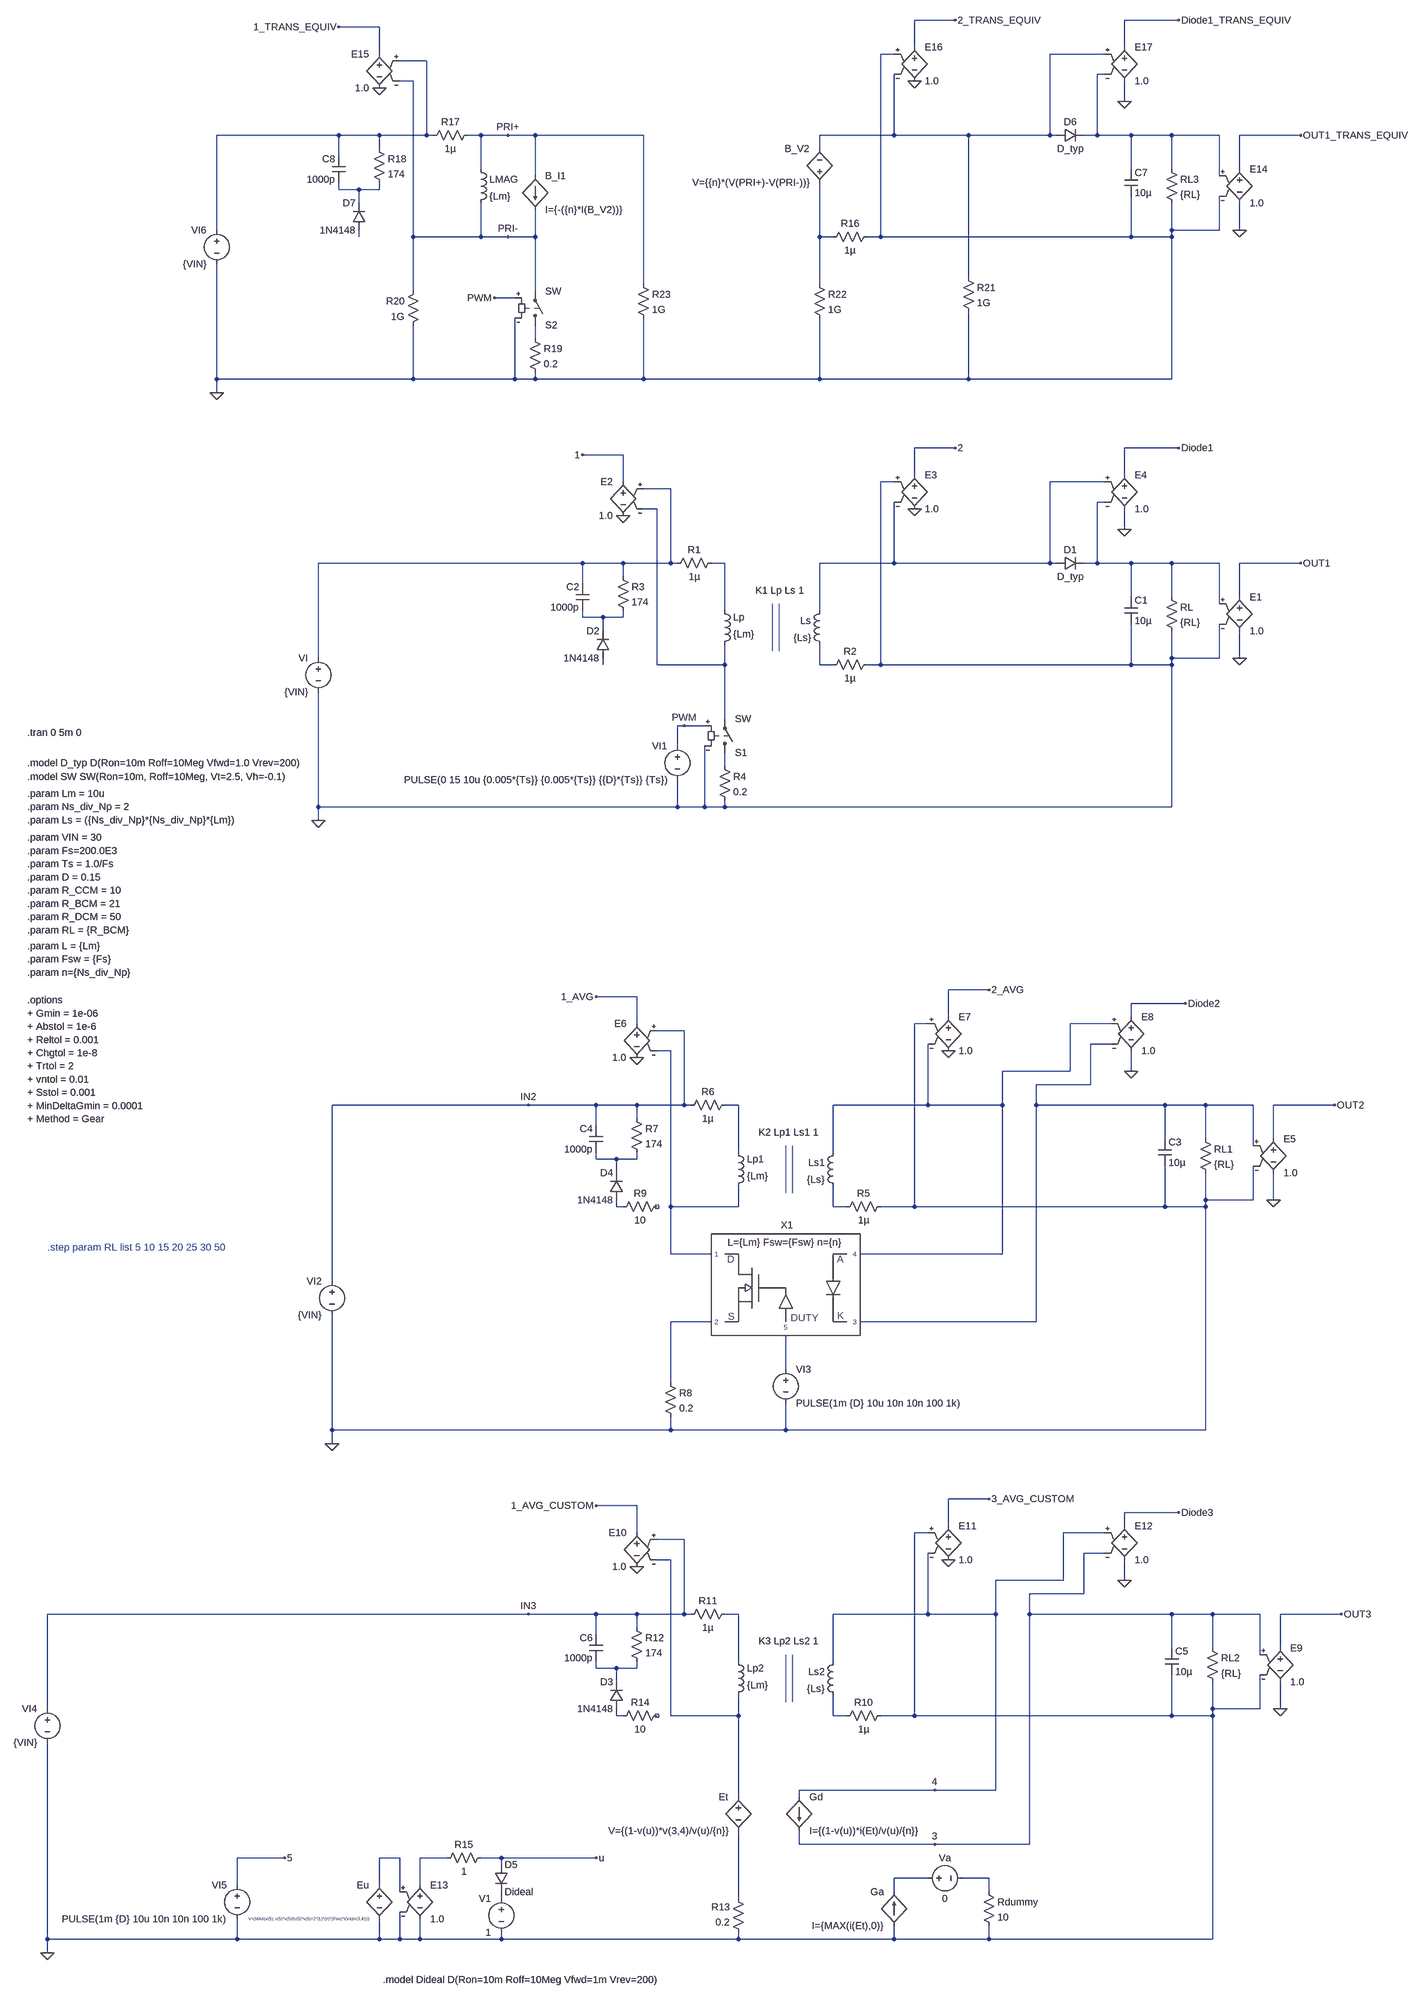
[diagram p0: schematic Flyback_Basic_Model.asc]
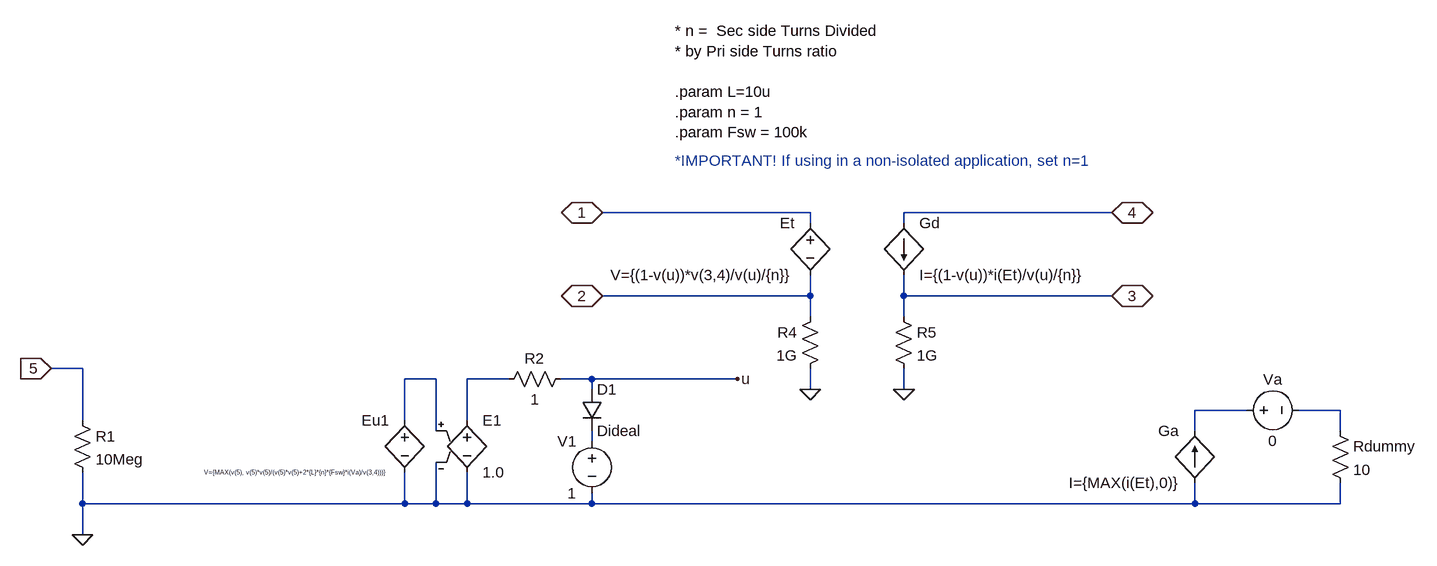
[diagram p1: sub-circuit ccm-dcm2.asc]
Flyback_Basic_Model.asc, the LTspice schematic file:
Version 4.1
SHEET 1 1936 3524
WIRE 624 -1312 528 -1312
WIRE 1152 -1312 1024 -1312
WIRE -736 -1296 -832 -1296
WIRE 528 -1248 528 -1312
WIRE 1024 -1248 1024 -1312
WIRE -736 -1232 -736 -1296
WIRE 480 -1232 448 -1232
WIRE 976 -1232 848 -1232
WIRE -624 -1216 -688 -1216
WIRE 976 -1184 960 -1184
WIRE -656 -1168 -688 -1168
WIRE 1024 -1120 1024 -1168
WIRE -832 -1040 -1120 -1040
WIRE -736 -1040 -832 -1040
WIRE -624 -1040 -624 -1216
WIRE -624 -1040 -736 -1040
WIRE -608 -1040 -624 -1040
WIRE -496 -1040 -528 -1040
WIRE -432 -1040 -496 -1040
WIRE -368 -1040 -432 -1040
WIRE -112 -1040 -368 -1040
WIRE 480 -1040 480 -1184
WIRE 480 -1040 304 -1040
WIRE 656 -1040 480 -1040
WIRE 848 -1040 848 -1232
WIRE 848 -1040 656 -1040
WIRE 864 -1040 848 -1040
WIRE 960 -1040 960 -1184
WIRE 960 -1040 928 -1040
WIRE 1040 -1040 960 -1040
WIRE 1136 -1040 1040 -1040
WIRE 1248 -1040 1136 -1040
WIRE 1440 -1040 1296 -1040
WIRE -736 -1008 -736 -1040
WIRE 304 -1008 304 -1040
WIRE -832 -992 -832 -1040
WIRE -496 -960 -496 -1040
WIRE 1040 -960 1040 -1040
WIRE 1136 -960 1136 -1040
WIRE 1296 -960 1296 -1040
WIRE -368 -944 -368 -1040
WIRE 1248 -944 1248 -1040
WIRE -832 -912 -832 -928
WIRE -784 -912 -832 -912
WIRE -736 -912 -736 -928
WIRE -736 -912 -784 -912
WIRE -784 -880 -784 -912
WIRE -1120 -816 -1120 -1040
WIRE 1136 -816 1136 -880
WIRE 1248 -816 1248 -896
WIRE 1248 -816 1136 -816
WIRE 1296 -816 1296 -880
WIRE -784 -800 -784 -816
WIRE -656 -800 -656 -1168
WIRE -496 -800 -496 -880
WIRE -496 -800 -656 -800
WIRE -432 -800 -496 -800
WIRE -368 -800 -368 -864
WIRE -368 -800 -432 -800
WIRE 304 -800 304 -928
WIRE 336 -800 304 -800
WIRE 448 -800 448 -1232
WIRE 448 -800 416 -800
WIRE 1040 -800 1040 -896
WIRE 1040 -800 448 -800
WIRE 1136 -800 1136 -816
WIRE 1136 -800 1040 -800
WIRE 656 -704 656 -1040
WIRE -112 -688 -112 -1040
WIRE 304 -688 304 -800
WIRE -656 -672 -656 -800
WIRE -368 -672 -368 -800
WIRE -416 -656 -464 -656
WIRE -368 -560 -368 -592
WIRE -1120 -464 -1120 -736
WIRE -656 -464 -656 -592
WIRE -656 -464 -1120 -464
WIRE -416 -464 -416 -608
WIRE -416 -464 -656 -464
WIRE -368 -464 -368 -480
WIRE -368 -464 -416 -464
WIRE -112 -464 -112 -608
WIRE -112 -464 -368 -464
WIRE 304 -464 304 -608
WIRE 304 -464 -112 -464
WIRE 656 -464 656 -624
WIRE 656 -464 304 -464
WIRE 1136 -464 1136 -800
WIRE 1136 -464 656 -464
WIRE -1120 -432 -1120 -464
WIRE 624 -288 528 -288
WIRE 1152 -288 1024 -288
WIRE -160 -272 -256 -272
WIRE 528 -224 528 -288
WIRE 1024 -224 1024 -288
WIRE -160 -208 -160 -272
WIRE 480 -208 448 -208
WIRE 976 -208 848 -208
WIRE -48 -192 -112 -192
WIRE 976 -160 960 -160
WIRE -80 -144 -112 -144
WIRE 1024 -96 1024 -144
WIRE -256 -16 -880 -16
WIRE -160 -16 -256 -16
WIRE -48 -16 -48 -192
WIRE -48 -16 -160 -16
WIRE -32 -16 -48 -16
WIRE 80 -16 48 -16
WIRE 480 -16 480 -160
WIRE 480 -16 304 -16
WIRE 848 -16 848 -208
WIRE 848 -16 480 -16
WIRE 864 -16 848 -16
WIRE 960 -16 960 -160
WIRE 960 -16 928 -16
WIRE 1040 -16 960 -16
WIRE 1136 -16 1040 -16
WIRE 1248 -16 1136 -16
WIRE 1440 -16 1296 -16
WIRE -160 16 -160 -16
WIRE -256 32 -256 -16
WIRE 1040 64 1040 -16
WIRE 1136 64 1136 -16
WIRE 1296 64 1296 -16
WIRE 1248 80 1248 -16
WIRE 80 96 80 -16
WIRE 304 96 304 -16
WIRE -256 112 -256 96
WIRE -208 112 -256 112
WIRE -160 112 -160 96
WIRE -160 112 -208 112
WIRE -208 144 -208 112
WIRE -880 208 -880 -16
WIRE 1136 208 1136 144
WIRE 1248 208 1248 128
WIRE 1248 208 1136 208
WIRE 1296 208 1296 144
WIRE -208 224 -208 208
WIRE -80 224 -80 -144
WIRE 80 224 80 176
WIRE 80 224 -80 224
WIRE 304 224 304 176
WIRE 336 224 304 224
WIRE 448 224 448 -208
WIRE 448 224 416 224
WIRE 1040 224 1040 128
WIRE 1040 224 448 224
WIRE 1136 224 1136 208
WIRE 1136 224 1040 224
WIRE 80 352 80 224
WIRE -16 368 -32 368
WIRE 32 368 -16 368
WIRE -32 416 -32 368
WIRE 80 464 80 432
WIRE -880 560 -880 288
WIRE -32 560 -32 496
WIRE -32 560 -880 560
WIRE 32 560 32 416
WIRE 32 560 -32 560
WIRE 80 560 80 544
WIRE 80 560 32 560
WIRE 1136 560 1136 224
WIRE 1136 560 80 560
WIRE -880 592 -880 560
WIRE 704 992 608 992
WIRE -128 1008 -224 1008
WIRE 1168 1024 1040 1024
WIRE 608 1056 608 992
WIRE 1040 1056 1040 1024
WIRE -128 1072 -128 1008
WIRE 560 1072 528 1072
WIRE 992 1072 896 1072
WIRE -16 1088 -80 1088
WIRE 992 1120 944 1120
WIRE -48 1136 -80 1136
WIRE 896 1184 896 1072
WIRE 896 1184 736 1184
WIRE 1040 1184 1040 1136
WIRE 944 1216 944 1120
WIRE 944 1216 816 1216
WIRE -384 1264 -848 1264
WIRE -224 1264 -384 1264
WIRE -128 1264 -224 1264
WIRE -16 1264 -16 1088
WIRE -16 1264 -128 1264
WIRE 0 1264 -16 1264
WIRE 112 1264 80 1264
WIRE 560 1264 560 1120
WIRE 560 1264 336 1264
WIRE 736 1264 736 1184
WIRE 736 1264 560 1264
WIRE 816 1264 816 1216
WIRE 1120 1264 816 1264
WIRE 1216 1264 1120 1264
WIRE 1328 1264 1216 1264
WIRE 1520 1264 1376 1264
WIRE -128 1296 -128 1264
WIRE -224 1312 -224 1264
WIRE 1120 1344 1120 1264
WIRE 1216 1344 1216 1264
WIRE 1376 1344 1376 1264
WIRE 1328 1360 1328 1264
WIRE 112 1376 112 1264
WIRE 336 1376 336 1264
WIRE -224 1392 -224 1376
WIRE -176 1392 -224 1392
WIRE -128 1392 -128 1376
WIRE -128 1392 -176 1392
WIRE -176 1424 -176 1392
WIRE 1216 1488 1216 1424
WIRE 1328 1488 1328 1408
WIRE 1328 1488 1216 1488
WIRE 1376 1488 1376 1424
WIRE -176 1504 -176 1488
WIRE -160 1504 -176 1504
WIRE -48 1504 -48 1136
WIRE 112 1504 112 1456
WIRE 112 1504 -48 1504
WIRE 336 1504 336 1456
WIRE 368 1504 336 1504
WIRE 528 1504 528 1072
WIRE 528 1504 448 1504
WIRE 1120 1504 1120 1408
WIRE 1120 1504 528 1504
WIRE 1216 1504 1216 1488
WIRE 1216 1504 1120 1504
WIRE -48 1616 -48 1504
WIRE 48 1616 -48 1616
WIRE 736 1616 736 1264
WIRE 736 1616 400 1616
WIRE -848 1680 -848 1264
WIRE 48 1776 -48 1776
WIRE 816 1776 816 1264
WIRE 816 1776 400 1776
WIRE 224 1888 224 1808
WIRE -48 1920 -48 1776
WIRE -848 2032 -848 1760
WIRE -48 2032 -48 2000
WIRE -48 2032 -848 2032
WIRE 224 2032 224 1968
WIRE 224 2032 -48 2032
WIRE 1216 2032 1216 1504
WIRE 1216 2032 224 2032
WIRE -848 2064 -848 2032
WIRE 704 2256 608 2256
WIRE -128 2272 -224 2272
WIRE 1152 2288 1024 2288
WIRE 608 2320 608 2256
WIRE 1024 2320 1024 2288
WIRE -128 2336 -128 2272
WIRE 560 2336 528 2336
WIRE 976 2336 880 2336
WIRE -16 2352 -80 2352
WIRE 976 2384 928 2384
WIRE -48 2400 -80 2400
WIRE 880 2448 880 2336
WIRE 880 2448 720 2448
WIRE 1024 2448 1024 2400
WIRE 928 2480 928 2384
WIRE 928 2480 800 2480
WIRE -384 2528 -1520 2528
WIRE -224 2528 -384 2528
WIRE -128 2528 -224 2528
WIRE -16 2528 -16 2352
WIRE -16 2528 -128 2528
WIRE 0 2528 -16 2528
WIRE 112 2528 80 2528
WIRE 560 2528 560 2384
WIRE 560 2528 336 2528
WIRE 720 2528 720 2448
WIRE 720 2528 560 2528
WIRE 800 2528 800 2480
WIRE 1136 2528 800 2528
WIRE 1232 2528 1136 2528
WIRE 1344 2528 1232 2528
WIRE 1536 2528 1392 2528
WIRE -128 2560 -128 2528
WIRE -224 2576 -224 2528
WIRE 1136 2608 1136 2528
WIRE 1232 2608 1232 2528
WIRE 1392 2608 1392 2528
WIRE 1344 2624 1344 2528
WIRE 112 2640 112 2528
WIRE 336 2640 336 2528
WIRE -224 2656 -224 2640
WIRE -176 2656 -224 2656
WIRE -128 2656 -128 2640
WIRE -128 2656 -176 2656
WIRE -176 2688 -176 2656
WIRE -1520 2752 -1520 2528
WIRE 1232 2752 1232 2688
WIRE 1344 2752 1344 2672
WIRE 1344 2752 1232 2752
WIRE 1392 2752 1392 2688
WIRE -176 2768 -176 2752
WIRE -160 2768 -176 2768
WIRE -48 2768 -48 2400
WIRE 112 2768 112 2720
WIRE 112 2768 -48 2768
WIRE 336 2768 336 2720
WIRE 368 2768 336 2768
WIRE 528 2768 528 2336
WIRE 528 2768 448 2768
WIRE 1136 2768 1136 2672
WIRE 1136 2768 528 2768
WIRE 1232 2768 1232 2752
WIRE 1232 2768 1136 2768
WIRE 576 2944 256 2944
WIRE 720 2944 720 2528
WIRE 720 2944 576 2944
WIRE 112 2960 112 2768
WIRE 256 2960 256 2944
WIRE 256 3072 256 3040
WIRE 576 3072 256 3072
WIRE 800 3072 800 2528
WIRE 800 3072 576 3072
WIRE -960 3104 -1072 3104
WIRE -688 3104 -736 3104
WIRE -576 3104 -640 3104
WIRE -448 3104 -496 3104
WIRE -224 3104 -448 3104
WIRE -448 3120 -448 3104
WIRE 560 3152 480 3152
WIRE 704 3152 640 3152
WIRE -1072 3168 -1072 3104
WIRE -736 3168 -736 3104
WIRE -640 3168 -640 3104
WIRE -688 3184 -688 3104
WIRE 480 3184 480 3152
WIRE 704 3184 704 3152
WIRE -448 3200 -448 3184
WIRE 112 3200 112 3040
WIRE -1520 3296 -1520 2832
WIRE -1072 3296 -1072 3248
WIRE -1072 3296 -1520 3296
WIRE -736 3296 -736 3248
WIRE -736 3296 -1072 3296
WIRE -688 3296 -688 3232
WIRE -688 3296 -736 3296
WIRE -640 3296 -640 3248
WIRE -640 3296 -688 3296
WIRE -448 3296 -448 3280
WIRE -448 3296 -640 3296
WIRE 112 3296 112 3280
WIRE 112 3296 -448 3296
WIRE 480 3296 480 3264
WIRE 480 3296 112 3296
WIRE 704 3296 704 3264
WIRE 704 3296 480 3296
WIRE 1232 3296 1232 2768
WIRE 1232 3296 704 3296
WIRE -1520 3328 -1520 3296
FLAG -880 592 0
FLAG 1296 208 0
FLAG 1440 -16 OUT1
FLAG -160 -128 0
FLAG 528 -144 0
FLAG -256 -272 1
FLAG 624 -288 2
FLAG 1024 -96 0
FLAG 1152 -288 Diode1
FLAG -848 2064 0
FLAG 1376 1488 0
FLAG 1520 1264 OUT2
FLAG -128 1152 0
FLAG 608 1136 0
FLAG -224 1008 1_AVG
FLAG 704 992 2_AVG
FLAG -384 1264 IN2
FLAG 1040 1184 0
FLAG 1168 1024 Diode2
FLAG -16 368 PWM
FLAG -1520 3328 0
FLAG 1392 2752 0
FLAG 1536 2528 OUT3
FLAG -128 2416 0
FLAG 608 2400 0
FLAG -224 2272 1_AVG_CUSTOM
FLAG 704 2256 3_AVG_CUSTOM
FLAG -384 2528 IN3
FLAG 1024 2448 0
FLAG 1152 2288 Diode3
FLAG -960 3104 5
FLAG -224 3104 u
FLAG 576 2944 4
FLAG 576 3072 3
FLAG -1120 -432 0
FLAG 1296 -816 0
FLAG 1440 -1040 OUT1_TRANS_EQUIV
FLAG -736 -1152 0
FLAG 528 -1168 0
FLAG -832 -1296 1_TRANS_EQUIV
FLAG 624 -1312 2_TRANS_EQUIV
FLAG 1024 -1120 0
FLAG 1152 -1312 Diode1_TRANS_EQUIV
FLAG -464 -656 PWM
FLAG -432 -1040 PRI+
FLAG -432 -800 PRI-
SYMBOL ind 64 192 M180
WINDOW 0 36 80 Left 2
WINDOW 3 36 40 Left 2
SYMATTR InstName Lp
SYMATTR Value {Lm}
SYMATTR Type ind
SYMBOL ind 320 80 M0
SYMATTR InstName Ls
SYMATTR Value {Ls}
SYMATTR Type ind
SYMBOL voltage -880 192 M0
WINDOW 123 0 0 Left 0
WINDOW 39 0 0 Left 0
SYMATTR InstName VI
SYMATTR Value {VIN}
SYMBOL voltage -32 400 M0
WINDOW 123 0 0 Left 0
WINDOW 39 0 0 Left 0
SYMATTR InstName VI1
SYMATTR Value PULSE(0 15 10u {0.005*{Ts}} {0.005*{Ts}} {{D}*{Ts}} {Ts})
SYMBOL res 1120 48 R0
SYMATTR InstName RL
SYMATTR Value {RL}
SYMBOL cap 1024 64 R0
SYMATTR InstName C1
SYMATTR Value 10µ
SYMBOL diode 864 0 R270
WINDOW 0 32 32 VTop 2
WINDOW 3 0 32 VBottom 2
SYMATTR InstName D1
SYMATTR Value D_typ
SYMBOL e 1296 48 R0
SYMATTR InstName E1
SYMATTR Value 1.0
SYMBOL res 432 208 R90
WINDOW 0 0 56 VBottom 2
WINDOW 3 32 56 VTop 2
SYMATTR InstName R2
SYMATTR Value 1µ
SYMBOL res -48 0 R270
WINDOW 0 32 56 VTop 2
WINDOW 3 0 56 VBottom 2
SYMATTR InstName R1
SYMATTR Value 1µ
SYMBOL e -160 -224 M0
SYMATTR InstName E2
SYMATTR Value 1.0
SYMBOL e 528 -240 R0
SYMATTR InstName E3
SYMATTR Value 1.0
SYMBOL sw 80 448 M180
SYMATTR InstName S1
SYMBOL diode -192 208 R180
WINDOW 0 24 64 Left 2
WINDOW 3 24 0 Left 2
SYMATTR InstName D2
SYMATTR Value 1N4148
SYMBOL cap -240 32 M0
SYMATTR InstName C2
SYMATTR Value 1000p
SYMBOL res -176 0 R0
SYMATTR InstName R3
SYMATTR Value 174
SYMBOL res 64 448 R0
SYMATTR InstName R4
SYMATTR Value 0.2
SYMBOL e 1024 -240 R0
SYMATTR InstName E4
SYMATTR Value 1.0
SYMBOL ind 96 1472 M180
WINDOW 0 36 80 Left 2
WINDOW 3 36 40 Left 2
SYMATTR InstName Lp1
SYMATTR Value {Lm}
SYMATTR Type ind
SYMBOL ind 352 1360 M0
SYMATTR InstName Ls1
SYMATTR Value {Ls}
SYMATTR Type ind
SYMBOL voltage -848 1664 M0
WINDOW 123 0 0 Left 0
WINDOW 39 0 0 Left 0
SYMATTR InstName VI2
SYMATTR Value {VIN}
SYMBOL res 1200 1328 R0
SYMATTR InstName RL1
SYMATTR Value {RL}
SYMBOL cap 1104 1344 R0
SYMATTR InstName C3
SYMATTR Value 10µ
SYMBOL e 1376 1328 R0
SYMATTR InstName E5
SYMATTR Value 1.0
SYMBOL res 464 1488 R90
WINDOW 0 0 56 VBottom 2
WINDOW 3 32 56 VTop 2
SYMATTR InstName R5
SYMATTR Value 1µ
SYMBOL res -16 1280 R270
WINDOW 0 32 56 VTop 2
WINDOW 3 0 56 VBottom 2
SYMATTR InstName R6
SYMATTR Value 1µ
SYMBOL e -128 1056 M0
SYMATTR InstName E6
SYMATTR Value 1.0
SYMBOL e 608 1040 R0
SYMATTR InstName E7
SYMATTR Value 1.0
SYMBOL diode -160 1488 R180
WINDOW 0 24 64 Left 2
WINDOW 3 24 0 Left 2
SYMATTR InstName D4
SYMATTR Value 1N4148
SYMBOL cap -208 1312 M0
SYMATTR InstName C4
SYMATTR Value 1000p
SYMBOL res -144 1280 R0
SYMATTR InstName R7
SYMATTR Value 174
SYMBOL e 1040 1040 R0
SYMATTR InstName E8
SYMATTR Value 1.0
SYMBOL voltage 224 1872 R0
WINDOW 123 0 0 Left 0
WINDOW 39 0 0 Left 0
SYMATTR InstName VI3
SYMATTR Value PULSE(1m {D} 10u 10n 10n 100 1k)
SYMBOL res -64 1904 R0
SYMATTR InstName R8
SYMATTR Value 0.2
SYMBOL res -64 1488 R90
WINDOW 0 0 56 VBottom 2
WINDOW 3 32 56 VTop 2
SYMATTR InstName R9
SYMATTR Value 10
SYMBOL ind 96 2736 M180
WINDOW 0 36 80 Left 2
WINDOW 3 36 40 Left 2
SYMATTR InstName Lp2
SYMATTR Value {Lm}
SYMATTR Type ind
SYMBOL ind 352 2624 M0
SYMATTR InstName Ls2
SYMATTR Value {Ls}
SYMATTR Type ind
SYMBOL voltage -1520 2736 M0
WINDOW 123 0 0 Left 0
WINDOW 39 0 0 Left 0
SYMATTR InstName VI4
SYMATTR Value {VIN}
SYMBOL res 1216 2592 R0
SYMATTR InstName RL2
SYMATTR Value {RL}
SYMBOL cap 1120 2608 R0
SYMATTR InstName C5
SYMATTR Value 10µ
SYMBOL e 1392 2592 R0
SYMATTR InstName E9
SYMATTR Value 1.0
SYMBOL res 464 2752 R90
WINDOW 0 0 56 VBottom 2
WINDOW 3 32 56 VTop 2
SYMATTR InstName R10
SYMATTR Value 1µ
SYMBOL res -16 2544 R270
WINDOW 0 32 56 VTop 2
WINDOW 3 0 56 VBottom 2
SYMATTR InstName R11
SYMATTR Value 1µ
SYMBOL e -128 2320 M0
SYMATTR InstName E10
SYMATTR Value 1.0
SYMBOL e 608 2304 R0
SYMATTR InstName E11
SYMATTR Value 1.0
SYMBOL diode -160 2752 R180
WINDOW 0 24 64 Left 2
WINDOW 3 24 0 Left 2
SYMATTR InstName D3
SYMATTR Value 1N4148
SYMBOL cap -208 2576 M0
SYMATTR InstName C6
SYMATTR Value 1000p
SYMBOL res -144 2544 R0
SYMATTR InstName R12
SYMATTR Value 174
SYMBOL e 1024 2304 R0
SYMATTR InstName E12
SYMATTR Value 1.0
SYMBOL voltage -1072 3152 M0
WINDOW 123 0 0 Left 0
WINDOW 39 0 0 Left 0
SYMATTR InstName VI5
SYMATTR Value PULSE(1m {D} 10u 10n 10n 100 1k)
SYMBOL res -64 2752 R90
WINDOW 0 0 56 VBottom 2
WINDOW 3 32 56 VTop 2
SYMATTR InstName R14
SYMATTR Value 10
SYMBOL res 128 3296 R180
WINDOW 0 36 76 Left 2
WINDOW 3 36 40 Left 2
SYMATTR InstName R13
SYMATTR Value 0.2
SYMBOL bv -736 3152 M0
WINDOW 3 24 96 Left 0
SYMATTR Value V={MAX(v(5), v(5)*v(5)/(v(5)*v(5)+2*{L}*{n}*{Fsw}*i(Va)/v(3,4)))}
SYMATTR InstName Eu
SYMBOL bv 112 2944 M0
SYMATTR InstName Et
SYMATTR Value V={(1-v(u))*v(3,4)/v(u)/{n}}
SYMBOL bi 256 2960 R0
SYMATTR InstName Gd
SYMATTR Value I={(1-v(u))*i(Et)/v(u)/{n}}
SYMBOL bi 480 3264 R180
WINDOW 0 24 80 Left 2
WINDOW 3 24 0 Left 2
SYMATTR InstName Ga
SYMATTR Value I={MAX(i(Et),0)}
SYMBOL voltage 544 3152 R270
WINDOW 0 32 56 VTop 2
WINDOW 3 -32 56 VBottom 2
WINDOW 123 0 0 Left 0
WINDOW 39 0 0 Left 0
SYMATTR InstName Va
SYMATTR Value 0
SYMBOL res 688 3168 R0
SYMATTR InstName Rdummy
SYMATTR Value 10
SYMBOL e -640 3152 R0
SYMATTR InstName E13
SYMATTR Value 1.0
SYMBOL res -480 3088 R90
WINDOW 0 0 56 VBottom 2
WINDOW 3 32 56 VTop 2
SYMATTR InstName R15
SYMATTR Value 1
SYMBOL diode -464 3120 R0
SYMATTR InstName D5
SYMATTR Value Dideal
SYMBOL voltage -448 3184 M0
WINDOW 123 0 0 Left 0
WINDOW 39 0 0 Left 0
SYMATTR InstName V1
SYMATTR Value 1
SYMBOL ccm-dcm2 224 1696 R0
WINDOW 0 3 -133 Bottom 2
WINDOW 39 -3 -92 Bottom 2
SYMATTR InstName X1
SYMATTR SpiceLine L={Lm} Fsw={Fsw} n={n}
SYMBOL ind -512 -976 R0
SYMATTR InstName LMAG
SYMATTR Value {Lm}
SYMBOL voltage -1120 -832 M0
WINDOW 123 0 0 Left 0
WINDOW 39 0 0 Left 0
SYMATTR InstName VI6
SYMATTR Value {VIN}
SYMBOL res 1120 -976 R0
SYMATTR InstName RL3
SYMATTR Value {RL}
SYMBOL cap 1024 -960 R0
SYMATTR InstName C7
SYMATTR Value 10µ
SYMBOL diode 864 -1024 R270
WINDOW 0 32 32 VTop 2
WINDOW 3 0 32 VBottom 2
SYMATTR InstName D6
SYMATTR Value D_typ
SYMBOL e 1296 -976 R0
SYMATTR InstName E14
SYMATTR Value 1.0
SYMBOL res 432 -816 R90
WINDOW 0 0 56 VBottom 2
WINDOW 3 32 56 VTop 2
SYMATTR InstName R16
SYMATTR Value 1µ
SYMBOL res -624 -1024 R270
WINDOW 0 32 56 VTop 2
WINDOW 3 0 56 VBottom 2
SYMATTR InstName R17
SYMATTR Value 1µ
SYMBOL e -736 -1248 M0
SYMATTR InstName E15
SYMATTR Value 1.0
SYMBOL e 528 -1264 R0
SYMATTR InstName E16
SYMATTR Value 1.0
SYMBOL sw -368 -576 M180
SYMATTR InstName S2
SYMBOL diode -768 -816 R180
WINDOW 0 24 64 Left 2
WINDOW 3 24 0 Left 2
SYMATTR InstName D7
SYMATTR Value 1N4148
SYMBOL cap -816 -992 M0
SYMATTR InstName C8
SYMATTR Value 1000p
SYMBOL res -752 -1024 R0
SYMATTR InstName R18
SYMATTR Value 174
SYMBOL res -384 -576 R0
SYMATTR InstName R19
SYMATTR Value 0.2
SYMBOL e 1024 -1264 R0
SYMATTR InstName E17
SYMATTR Value 1.0
SYMBOL bi -368 -944 R0
SYMATTR InstName B_I1
SYMATTR Value I={-({n}*I(B_V2))}
SYMBOL bv 304 -912 R180
WINDOW 0 24 96 Left 2
WINDOW 3 24 16 Left 2
SYMATTR InstName B_V2
SYMATTR Value V={{n}*(V(PRI+)-V(PRI-))}
SYMBOL res -640 -688 M0
SYMATTR InstName R20
SYMATTR Value 1G
SYMBOL res 640 -720 R0
SYMATTR InstName R21
SYMATTR Value 1G
SYMBOL res 288 -704 R0
SYMATTR InstName R22
SYMATTR Value 1G
SYMBOL res -128 -704 R0
SYMATTR InstName R23
SYMATTR Value 1G
TEXT 152 48 Left 2 !K1 Lp Ls 1
TEXT -1568 384 Left 2 !.tran 0 5m 0
TEXT -1568 488 Left 2 !.model SW SW(Ron=10m, Roff=10Meg, Vt=2.5, Vh=-0.1)
TEXT -1568 632 Left 2 !.param VIN = 30\n.param Fs=200.0E3\n.param Ts = 1.0/Fs\n.param D = 0.15\n.param R_CCM = 10\n.param R_BCM = 21\n.param R_DCM = 50\n.param RL = {R_BCM}
TEXT -1568 456 Left 2 !.model D_typ D(Ron=10m Roff=10Meg Vfwd=1.0 Vrev=200)
TEXT -1568 528 Left 2 !.param Lm = 10u\n.param Ns_div_Np = 2\n.param Ls = ({Ns_div_Np}*{Ns_div_Np}*{Lm})
TEXT 160 1328 Left 2 !K2 Lp1 Ls1 1
TEXT 160 2592 Left 2 !K3 Lp2 Ls2 1
TEXT -1568 888 Left 2 !.param L = {Lm}\n.param Fsw = {Fs}\n.param n={Ns_div_Np}
TEXT -728 3392 Left 2 !.model Dideal D(Ron=10m Roff=10Meg Vfwd=1m Vrev=200)
TEXT -1568 1016 Left 2 !.options\n+ Gmin = 1e-06\n+ Abstol = 1e-6\n+ Reltol = 0.001\n+ Chgtol = 1e-8\n+ Trtol = 2\n+ vntol = 0.01\n+ Sstol = 0.001\n+ MinDeltaGmin = 0.0001\n+ Method = Gear
TEXT -1520 1600 Left 2 ;.step param RL list 5 10 15 20 25 30 50
LINE Normal 192 192 192 80
LINE Normal 208 192 208 80
LINE Normal 224 1472 224 1360
LINE Normal 240 1472 240 1360
LINE Normal 224 2736 224 2624
LINE Normal 240 2736 240 2624

ccm-dcm2.asc, the sub-circuit schematic file:
Version 4.1
SHEET 1 1388 680
WIRE 432 -224 112 -224
WIRE 896 -224 576 -224
WIRE 432 -208 432 -224
WIRE 576 -208 576 -224
WIRE 432 -96 432 -128
WIRE 432 -96 112 -96
WIRE 576 -96 576 -128
WIRE 896 -96 576 -96
WIRE 432 -64 432 -96
WIRE 576 -64 576 -96
WIRE -688 16 -736 16
WIRE -144 32 -192 32
WIRE -32 32 -96 32
WIRE 96 32 48 32
WIRE 320 32 96 32
WIRE 96 48 96 32
WIRE 432 48 432 16
WIRE 576 48 576 16
WIRE 1104 80 1024 80
WIRE 1248 80 1184 80
WIRE -688 96 -688 16
WIRE -192 96 -192 32
WIRE -96 96 -96 32
WIRE -144 112 -144 32
WIRE 1024 112 1024 80
WIRE 1248 112 1248 80
WIRE 96 128 96 112
WIRE -688 224 -688 176
WIRE -192 224 -192 176
WIRE -192 224 -688 224
WIRE -144 224 -144 160
WIRE -144 224 -192 224
WIRE -96 224 -96 176
WIRE -96 224 -144 224
WIRE 96 224 96 208
WIRE 96 224 -96 224
WIRE 1024 224 1024 192
WIRE 1024 224 96 224
WIRE 1248 224 1248 192
WIRE 1248 224 1024 224
WIRE -688 272 -688 224
FLAG -736 16 5
IOPIN -736 16 In
FLAG 320 32 u
FLAG 896 -224 4
IOPIN 896 -224 BiDir
FLAG 896 -96 3
IOPIN 896 -96 BiDir
FLAG 112 -224 1
IOPIN 112 -224 BiDir
FLAG 112 -96 2
IOPIN 112 -96 BiDir
FLAG -688 272 0
FLAG 432 48 0
FLAG 576 48 0
SYMBOL bv -192 80 M0
WINDOW 3 24 96 Left 0
SYMATTR Value V={MAX(v(5), v(5)*v(5)/(v(5)*v(5)+2*{L}*{n}*{Fsw}*i(Va)/v(3,4)))}
SYMATTR InstName Eu1
SYMBOL bv 432 -224 M0
SYMATTR InstName Et
SYMATTR Value V={(1-v(u))*v(3,4)/v(u)/{n}}
SYMBOL bi 576 -208 R0
SYMATTR InstName Gd
SYMATTR Value I={(1-v(u))*i(Et)/v(u)/{n}}
SYMBOL bi 1024 192 R180
WINDOW 0 24 80 Left 2
WINDOW 3 24 0 Left 2
SYMATTR InstName Ga
SYMATTR Value I={MAX(i(Et),0)}
SYMBOL voltage 1088 80 R270
WINDOW 0 32 56 VTop 2
WINDOW 3 -32 56 VBottom 2
WINDOW 123 0 0 Left 0
WINDOW 39 0 0 Left 0
SYMATTR InstName Va
SYMATTR Value 0
SYMBOL res 1232 96 R0
SYMATTR InstName Rdummy
SYMATTR Value 10
SYMBOL e -96 80 R0
SYMATTR InstName E1
SYMATTR Value 1.0
SYMBOL res 64 16 R90
WINDOW 0 0 56 VBottom 2
WINDOW 3 32 56 VTop 2
SYMATTR InstName R2
SYMATTR Value 1
SYMBOL diode 80 48 R0
SYMATTR InstName D1
SYMATTR Value Dideal
SYMBOL voltage 96 112 M0
WINDOW 123 0 0 Left 0
WINDOW 39 0 0 Left 0
SYMATTR InstName V1
SYMATTR Value 1
SYMBOL res -704 80 R0
SYMATTR InstName R1
SYMATTR Value 10Meg
SYMBOL res 448 -80 M0
SYMATTR InstName R4
SYMATTR Value 1G
SYMBOL res 560 -80 R0
SYMATTR InstName R5
SYMATTR Value 1G
TEXT 224 -504 Left 2 !* n =  Sec side Turns Divided\n* by Pri side Turns ratio\n \n.param L=10u\n.param n = 1\n.param Fsw = 100k
TEXT 224 -304 Left 2 ;*IMPORTANT! If using in a non-isolated application, set n=1

The netlist it stands for:
* Flyback_Basic_Model.asc
Lp N011 N012 {Lm}
Ls N008 N015 {Ls}
VI N009 0 {VIN}
VI1 PWM 0 PULSE(0 15 10u {0.005*{Ts}} {0.005*{Ts}} {{D}*{Ts}} {Ts})
RL N010 0 {RL}
C1 N010 0 10µ
D1 N008 N010 D_typ
E1 OUT1 0 N010 0 1.0
R2 0 N015 1µ
R1 N009 N012 1µ
E2 1 0 N009 N011 1.0
E3 2 0 0 N008 1.0
S1 N016 N011 PWM 0 SW
D2 N014 N013 1N4148
C2 N009 N013 1000p
R3 N009 N013 174
R4 N016 0 0.2
E4 Diode1 0 N008 N010 1.0
Lp1 N019 N020 {Lm}
Ls1 N017 N023 {Ls}
VI2 IN2 0 {VIN}
RL1 N018 0 {RL}
C3 N018 0 10µ
E5 OUT2 0 N018 0 1.0
R5 0 N023 1µ
R6 IN2 N020 1µ
E6 1_AVG 0 IN2 N019 1.0
E7 2_AVG 0 0 N017 1.0
D4 N022 N021 1N4148
C4 IN2 N021 1000p
R7 IN2 N021 174
E8 Diode2 0 N017 N018 1.0
VI3 N025 0 PULSE(1m {D} 10u 10n 10n 100 1k)
R8 N024 0 0.2
R9 NC_01 N022 10
Lp2 N026 N027 {Lm}
Ls2 4 N030 {Ls}
VI4 IN3 0 {VIN}
RL2 3 0 {RL}
C5 3 0 10µ
E9 OUT3 0 3 0 1.0
R10 0 N030 1µ
R11 IN3 N027 1µ
E10 1_AVG_CUSTOM 0 IN3 N026 1.0
E11 3_AVG_CUSTOM 0 0 4 1.0
D3 N029 N028 1N4148
C6 IN3 N028 1000p
R12 IN3 N028 174
E12 Diode3 0 4 3 1.0
VI5 5 0 PULSE(1m {D} 10u 10n 10n 100 1k)
R14 NC_02 N029 10
R13 0 N036 0.2
B§Eu N031 0 V={MAX(v(5), v(5)*v(5)/(v(5)*v(5)+2*{L}*{n}*{Fsw}*i(Va)/v(3,4)))}
B§Et N026 N036 V={(1-v(u))*v(3,4)/v(u)/{n}}
B§Gd 4 3 I={(1-v(u))*i(Et)/v(u)/{n}}
B§Ga 0 N033 I={MAX(i(Et),0)}
Va N033 N034 0
Rdummy N034 0 10
E13 N032 0 N031 0 1.0
R15 u N032 1
D5 u N035 Dideal
V1 N035 0 1
X§X1 N025 N019 N024 N018 N017 ccm-dcm2 params: L={Lm} Fsw={Fsw} n={n}
LMAG PRI+ PRI- {Lm}
VI6 N002 0 {VIN}
RL3 N003 0 {RL}
C7 N003 0 10µ
D6 N001 N003 D_typ
E14 OUT1_TRANS_EQUIV 0 N003 0 1.0
R16 0 N006 1µ
R17 N002 PRI+ 1µ
E15 1_TRANS_EQUIV 0 N002 PRI- 1.0
E16 2_TRANS_EQUIV 0 0 N001 1.0
S2 N007 PRI- PWM 0 SW
D7 N005 N004 1N4148
C8 N002 N004 1000p
R18 N002 N004 174
R19 N007 0 0.2
E17 Diode1_TRANS_EQUIV 0 N001 N003 1.0
B_I1 PRI+ PRI- I={-({n}*I(B_V2))}
B_V2 N006 N001 V={{n}*(V(PRI+)-V(PRI-))}
R20 PRI- 0 1G
R21 N001 0 1G
R22 N006 0 1G
R23 PRI+ 0 1G

* block symbol definitions
.subckt ccm-dcm2 5 1 2 3 4
B§Eu1 N001 0 V={MAX(v(5), v(5)*v(5)/(v(5)*v(5)+2*{L}*{n}*{Fsw}*i(Va)/v(3,4)))}
B§Et 1 2 V={(1-v(u))*v(3,4)/v(u)/{n}}
B§Gd 4 3 I={(1-v(u))*i(Et)/v(u)/{n}}
B§Ga 0 N003 I={MAX(i(Et),0)}
Va N003 N004 0
Rdummy N004 0 10
E1 N002 0 N001 0 1.0
R2 u N002 1
D1 u N005 Dideal
V1 N005 0 1
R1 5 0 10Meg
R4 2 0 1G
R5 3 0 1G
* n =  Sec side Turns Divided
* by Pri side Turns ratio
.param L=10u
.param n = 1
.param Fsw = 100k
* *IMPORTANT! If using in a non-isolated application, set n=1
.ends ccm-dcm2

.model D D
.lib standard.dio
K1 Lp Ls 1
.tran 0 5m 0
.model SW SW(Ron=10m, Roff=10Meg, Vt=2.5, Vh=-0.1)
.param VIN = 30
.param Fs=200.0E3
.param Ts = 1.0/Fs
.param D = 0.15
.param R_CCM = 10
.param R_BCM = 21
.param R_DCM = 50
.param RL = {R_BCM}
.model D_typ D(Ron=10m Roff=10Meg Vfwd=1.0 Vrev=200)
.param Lm = 10u
.param Ns_div_Np = 2
.param Ls = ({Ns_div_Np}*{Ns_div_Np}*{Lm})
K2 Lp1 Ls1 1
K3 Lp2 Ls2 1
.param L = {Lm}
.param Fsw = {Fs}
.param n={Ns_div_Np}
.model Dideal D(Ron=10m Roff=10Meg Vfwd=1m Vrev=200)
.options
+ Gmin = 1e-06
+ Abstol = 1e-6
+ Reltol = 0.001
+ Chgtol = 1e-8
+ Trtol = 2
+ vntol = 0.01
+ Sstol = 0.001
+ MinDeltaGmin = 0.0001
+ Method = Gear
* .step param RL list 5 10 15 20 25 30 50
.backanno
.end